# EAGLE design GPS Dog Tracker receiver (EAGLE 7.5.0)
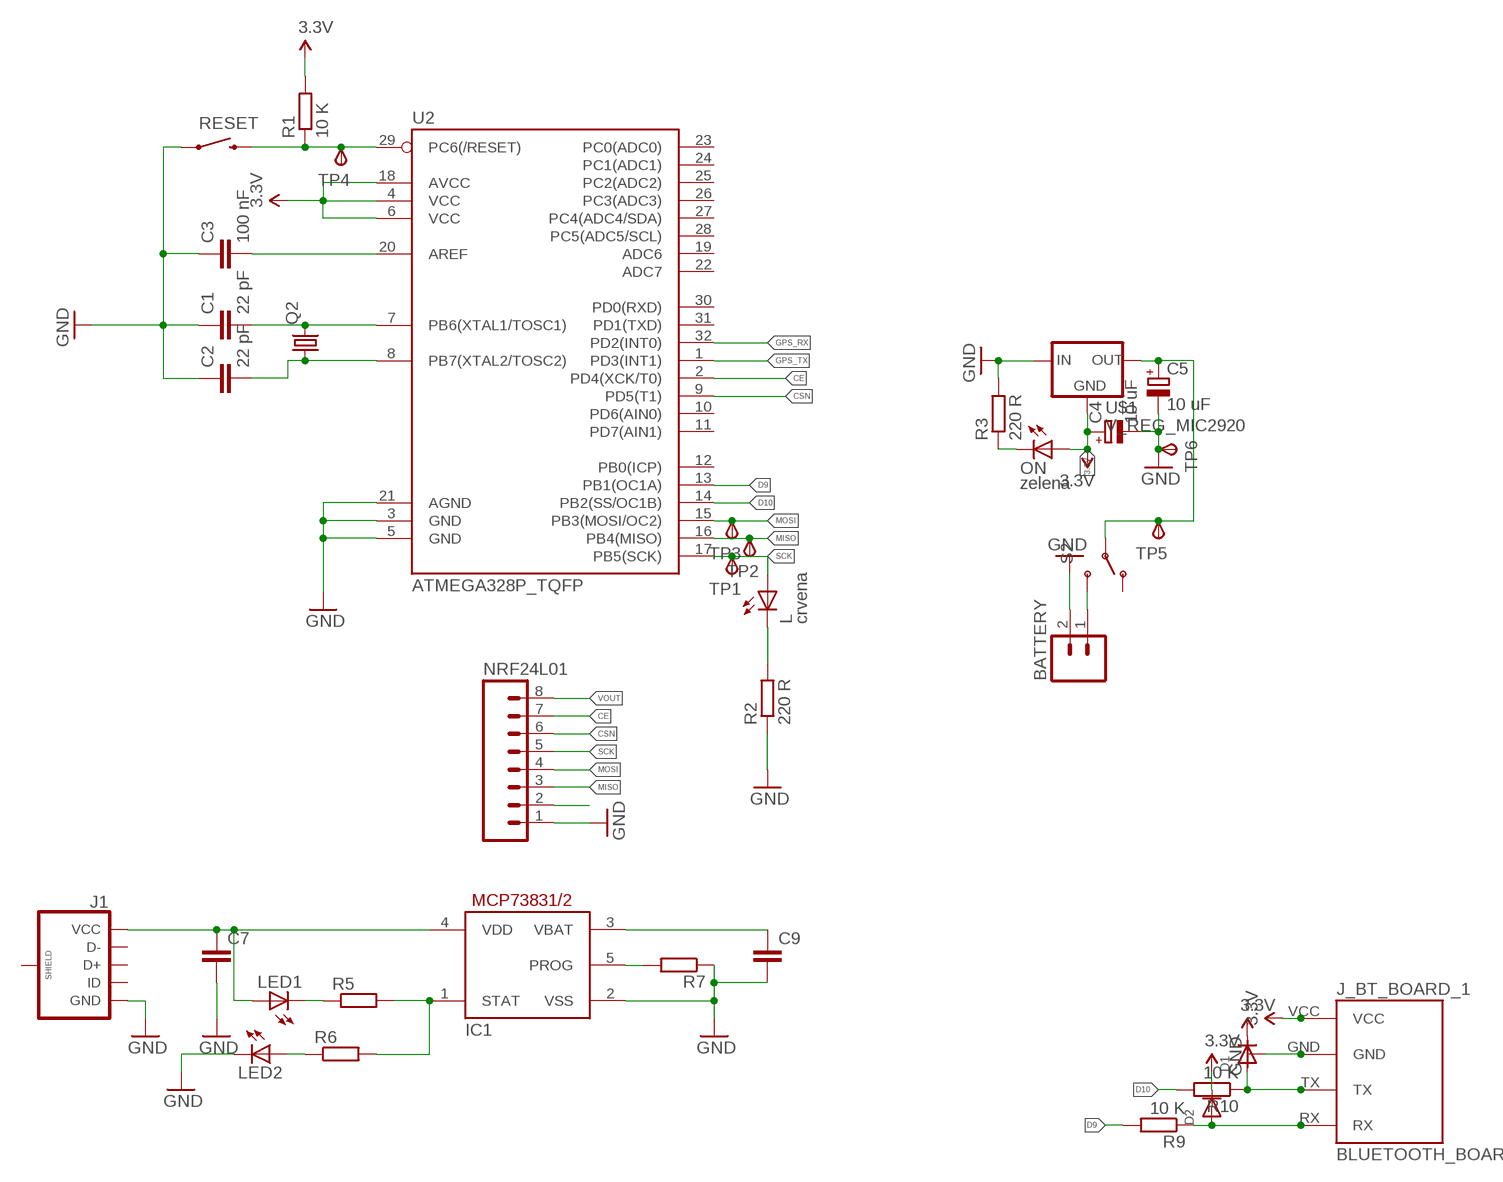
[diagram p0: schematic, sheet 1]

## Parts
BATTERY  M021X02_NO_SILK  [1X02_NO_SILK]
C1  22 pF  C-EUC0603  [C0603]
C2  22 pF  C-EUC0603  [C0603]
C3  100 nF  C-EUC0603  [C0603]
C4  10 uF  CPOL-EUSMCA  [SMC_A]
C5  10 uF  CPOL-EUSMCA  [SMC_A]
C7  C-EUC0603  [C0603]
C9  C-EUC0603  [C0603]
D1  DIODESOD-123  [SOD-123]
D2  DIODESOD-123  [SOD-123]
IC1  MCP73831/OT  [SOT23-5L]
J1  USB_MICROB_PLUGCONN-11752  [USB-B-MICRO-SMD_V03]
J_BT_BOARD_1  BLUETOOTH_BOARD  [BT_BOARD_FOOTPRINT]
L  crvena  LEDCHIP-LED0805  [CHIP-LED0805]
LED1  LEDCHIPLED_0805  [CHIPLED_0805]
LED2  LEDCHIPLED_0805  [CHIPLED_0805]
NRF24L01  M08SILK_FEMALE_PTH  [1X08]
ON  zelena  LEDCHIP-LED0805  [CHIP-LED0805]
Q2  CRYSTALHC49S  [HC49/S]
R1  10 K  R-EU_R0603  [R0603]
R2  220 R  R-EU_R0603  [R0603]
R3  220 R  R-EU_R0603  [R0603]
R5  R-EU_R0603  [R0603]
R6  R-EU_R0603  [R0603]
R7  R-EU_R0603  [R0603]
R9  10 K  R-EU_R0603  [R0603]
R10  10 K  R-EU_R0603  [R0603]
RESET  SWITCH-MOMENTARY-2SMD-1101NE  [TACTILE-SWITCH-1101NE]
S2  SWITCH-SPDT-SMD-A  [SWITCH-SPST-SMD-A]
TP1  TPSTP13R  [TP13R]
TP2  TPSTP13R  [TP13R]
TP3  TPSTP13R  [TP13R]
TP4  TPSTP13R  [TP13R]
TP5  TPSTP13R  [TP13R]
TP6  TPSTP13R  [TP13R]
U2  ATMEGA328P_TQFP  [TQFP32-08]
U$1  V_REG_MIC2920  [SOT223]

## Nets
3.3V: C4.+ D1.C D2.C J_BT_BOARD_1.VCC ON.A R1.2 U2.4(VCC) U2.6(VCC) U2.18(AVCC) U$1.2(GND)
CE: NRF24L01.7 U2.2(PD4(XCK/T0))
CSN: NRF24L01.6 U2.9(PD5(T1))
D9: R9.2 U2.13(PB1(OC1A))
D10: R10.2 U2.14(PB2(SS/OC1B))
GND: BATTERY.2 C1.1 C2.1 C3.1 C4.- C5.- C7.2 C9.2 IC1.2(VSS) J1.GND J_BT_BOARD_1.GND LED2.C NRF24L01.1 R2.1 R3.2 R7.1 RESET.1 TP6.TP(PP) U2.3(GND) U2.5(GND) U2.21(AGND) U$1.1(IN)
GPS_RX: U2.32(PD2(INT0))
GPS_TX: U2.1(PD3(INT1))
MISO: NRF24L01.3 TP2.TP(PP) U2.16(PB4(MISO))
MOSI: NRF24L01.4 TP3.TP(PP) U2.15(PB3(MOSI/OC2))
N$1: C1.2 Q2.2 U2.7(PB6(XTAL1/TOSC1))
N$2: C2.2 Q2.1 U2.8(PB7(XTAL2/TOSC2))
N$3: C3.2 U2.20(AREF)
N$4: ON.C R3.1
N$7: NRF24L01.2
N$8: L.C R2.2
N$9: IC1.1(STAT) R5.2 R6.2
N$10: LED1.C R5.1
N$11: LED2.A R6.1
N$13: IC1.5(PROG) R7.2
N$14: D2.A J_BT_BOARD_1.RX R9.1
N$15: D1.A J_BT_BOARD_1.TX R10.1
RESET: R1.1 RESET.2 TP4.TP(PP) U2.29(PC6(/RESET))
SCK: L.A NRF24L01.5 TP1.TP(PP) U2.17(PB5(SCK))
VIN: BATTERY.1 C9.1 IC1.3(VBAT) S2.3(S)
VIN1: C5.+ C7.1 IC1.4(VDD) J1.VBUS(VCC) LED1.A S2.2(P) TP5.TP(PP) U$1.3(OUT)
VOUT: NRF24L01.8
Unconnected: J1.D+ J1.D- J1.ID J1.SHIELD1(SHIELD) J1.SHIELD2(SHIELD) J1.SHIELD3(SHIELD) S2.1(O) U2.10(PD6(AIN0)) U2.11(PD7(AIN1)) U2.12(PB0(ICP)) U2.19(ADC6) U2.22(ADC7) U2.23(PC0(ADC0)) U2.24(PC1(ADC1)) U2.25(PC2(ADC2)) U2.26(PC3(ADC3)) U2.27(PC4(ADC4/SDA)) U2.28(PC5(ADC5/SCL)) U2.30(PD0(RXD)) U2.31(PD1(TXD))

## Library data of the parts
BATTERY = SparkFun-Connectors:M02: Standard 2-pin 0.1" header. Use with - straight break away headers ( PRT-00116) - right angle break away headers (PRT-00553) - swiss pins (PRT-00743) - machine pins (PRT-00117) - female headers (PRT-00115) Molex polarized connector foot print use with: PRT-08233 with associated crimp pins and housings. 2.54_SCREWTERM for use with PRT-10571. 3.5mm Screw Terminal footprints for PRT-08084 5mm Screw Terminal footprints for use with PRT-08432
C1-C3 = rcl:C-EU: CAPACITOR, European symbol
C4 C5 = resistor:CPOL-EU: POLARIZED CAPACITOR, European symbol
C7 C9 = resistor:C-EU: CAPACITOR, European symbol
D1 D2 = adafruit:DIODE: Diode SMADIODE - SMA Surface Mount Package 20V 1A Schottky Diode Digikey: 641-1014-6-ND DO-1N4148 - Through Hole Small Current Diode SOD-123 20V 1 A (.5mV Vf) Schottky Diode - Digikey: MBRX120TPMSCT-ND SOD-323 10V 570mA (.38mV Vf, 3ns) Schottky Diode - Digikey: ZLLS410CT-ND SOD-523 30V 30mA Schottky Diode (RB751S-40TE61) - Digikey: RB751S-40TE61CT-ND SOT23-R/W - SOT23 Package (R = Solder Paste/Reflow Ovens, W = Hand-Soldering) BAT54Film 40V 300mA - Digikey: 497-7162-1-ND
IC1 = adafruit:MCP73831: MCP73831/2 Miniature Single-Cell, Fully Integrated Li-Ion, Li-Polymer Charge Management Controllers. Nice and small simple lipoly charge controller, with adjustable current and status output (LED) http://www.ladyada.net/library/pcb/eaglelibrary.html
J1 = SparkFun-Connectors:USB_MICROB_PLUG: USB Micro-B connectors Some male, some female. Watch your step!; PROD_ID: CONN-11752
J_BT_BOARD_1 = Bluetooth HC-05:BLUETOOTH_BOARD: Bluetooth Board V1.05
L LED1 LED2 ON = adafruit:LED: LED OSRAM: - CHIPLED LG R971, LG N971, LY N971, LG Q971, LY Q971, LO R971, LY R971 LH N974, LH R974 LS Q976, LO Q976, LY Q976 LO Q996 - Hyper CHIPLED LW Q18S LB Q993, LB Q99A, LB R99A - SideLED LS A670, LO A670, LY A670, LG A670, LP A670 LB A673, LV A673, LT A673, LW A673 LH A674 LY A675 LS A676, LA A676, LO A676, LY A676, LW A676 LS A679, LY A679, LG A679 - Hyper Micro SIDELED® LS Y876, LA Y876, LO Y876, LY Y876 LT Y87S - SmartLED LW L88C, LW L88S LB L89C, LB L89S, LG L890 LS L89K, LO L89K, LY L89K LS L896, LA L896, LO L896, LY L896 - TOPLED LS T670, LO T670, LY T670, LG T670, LP T670 LSG T670, LSP T670, LSY T670, LOP T670, LYG T670 LG T671, LOG T671, LSG T671 LB T673, LV T673, LT T673, LW T673 LH T674 LS T676, LA T676, LO T676, LY T676, LB T676, LH T676, LSB T676, LW T676 LB T67C, LV T67C, LT T67C, LS T67K, LO T67K, LY T67K, LW E67C LS E67B, LA E67B, LO E67B, LY E67B, LB E67C, LV E67C, LT E67C LW T67C LS T679, LY T679, LG T679 LS T770, LO T770, LY T770, LG T770, LP T770 LB T773, LV T773, LT T773, LW T773 LH T774 LS E675, LA E675, LY E675, LS T675 LS T776, LA T776, LO T776, LY T776, LB T776 LHGB T686 LT T68C, LB T68C - Hyper Mini TOPLED® LB M676 - Mini TOPLED Santana® LG M470 LS M47K, LO M47K, LY M47K Source: http://www.osram.convergy.de/
NRF24L01 = SparkFun-Connectors:M08: Header 8 Standard 8-pin 0.1" header. Use with straight break away headers (SKU : PRT-00116), right angle break away headers (PRT-00553), swiss pins (PRT-00743), machine pins (PRT-00117), and female headers (PRT-00115).; PROD_ID: CONN-08438
Q2 = adafruit:CRYSTAL: CRYSTAL; OC_FARNELL: 1667008; OC_NEWARK: unknown
R1-R3 R5-R7 R9 R10 = rcl:R-EU_: RESISTOR, European symbol
RESET = SparkFun-Electromechanical:SWITCH-MOMENTARY-2: Various NO switches- pushbuttons, reed, etc; PROD_ID: SWCH-00815
S2 = SparkFun-Electromechanical:SWITCH-SPDT: SPDT Switch Simple slide switch, Spark Fun Electronics SKU : COM-00102 DPDT SMT slide switch, AYZ0202, SWCH-08179; PROD_ID: SWCH-10651
TP1-TP6 = testpad:TPS: TEST PIN
U2 = SparkFun-DigitalIC:ATMEGA328P_TQFP; PROD_ID: IC-09069
U$1 = SparkFun-PowerIC:V_REG_MIC2920: MIC2920A (http://www.micrel.com/_PDF/mic2920.pdf) - 400mA output LDO Regulator

## Board
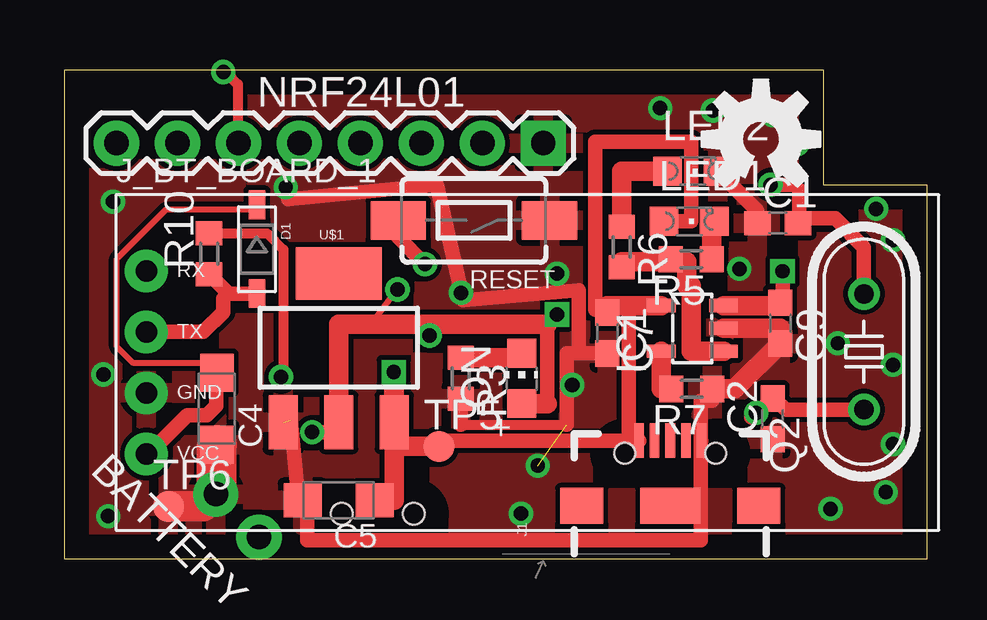
[diagram p1: board, top side]
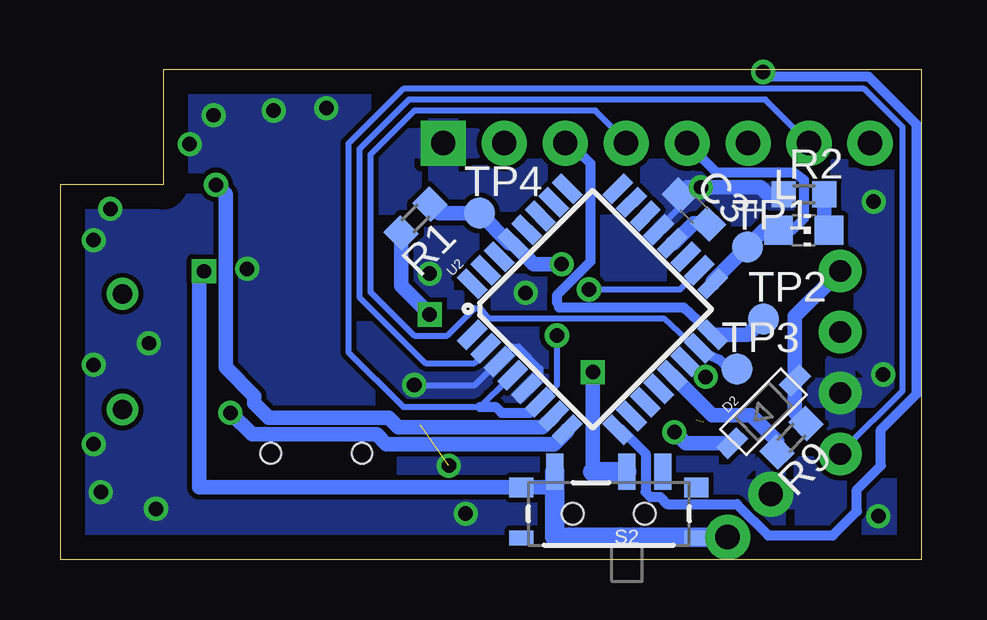
[diagram p2: board, bottom side, seen from below]

Size 35.9 x 20.4 mm. Coordinates in mm from the lower left corner, seen from the top.
Outline: 0,20.4 31.6,20.4 31.6,15.6 35.9,15.6 35.9,0 0,0 0,20.4
Copper layers (1*16): Top 0.035mm / dielectric 1.5mm / Bottom 0.035mm
Design rules "default": minimum track width 10mil, minimum drill 24mil, track to track 8mil, track to pad 8mil, pad to pad 8mil, via to via 8mil, smd to smd 8mil, copper to edge 40mil, drill to drill 8mil, minimum pad ring 10mil, minimum via ring 8mil, stop-mask expansion 4mil, vias tented up to drill 0mil, thermal gap 10mil

### Footprints (pad centres in the part's own frame; a part is rotated, then mirrored left to right if it is on the bottom)
1X02_NO_SILK = drill 1.016 pad 1.88: 1 0,0; 2 2.54,0
C0603 = smd 1.1 x 1: 1 -0.85,0; 2 0.85,0
SMC_A = smd 1.6 x 1.4: + -1.5,0; - 1.5,0
SOD-123 = smd 1.2 x 0.7: A 1.85,0; C -1.85,0
SOT23-5L = smd 0.55 x 1.2: 1 -0.95,-1.3; 2 0,-1.3; 3 0.95,-1.3; 4 0.95,1.3; 5 -0.95,1.3
USB-B-MICRO-SMD_V03 = smd 1.45 x 0.4: D+ 2.725,0; D- 2.725,0.65; GND 2.725,-1.3; ID 2.725,-0.65; VBUS 2.725,1.3 | smd 1.5 x 1.8: SHIELD1 0,3.685; SHIELD2 0,-3.685 | smd 1.5 x 2.5: SHIELD3 0,0 | hole 0.85: 2.2,1.9; 2.2,-1.9
BT_BOARD_FOOTPRINT = drill 0.9 pad 1.778: GND -16.51,-1.27; RX -16.51,3.81; TX -16.51,1.27; VCC -16.51,-3.81
CHIP-LED0805 = smd 1.2 x 1.2: A 0,-1.05; C 0,1.05
CHIPLED_0805 = smd 1.2 x 1.2: A 0,-1.05; C 0,1.05
1X08 = drill 1.016 pad 1.88 square: 1 0,0 | drill 1.016 pad 1.88: 2 2.54,0; 3 5.08,0; 4 7.62,0; 5 10.16,0; 6 12.7,0; 7 15.24,0; 8 17.78,0
HC49/S = drill 0.813: 1 -2.413,0; 2 2.413,0
R0603 = smd 1 x 1.1: 1 -0.85,0; 2 0.85,0
TACTILE-SWITCH-1101NE = smd 2.3 x 1.6: 1 -3.15,0; 2 3.15,0
SWITCH-SPST-SMD-A = smd 0.7 x 1.5: 1 -2.25,-1.75; 2 -0.75,-1.75; 3 2.25,-1.75 | smd 1 x 0.6: GND1 -3.65,1; GND3 3.65,1 | smd 1 x 0.8: GND2 -3.65,-1.1; GND4 3.65,-1.1 | hole 0.9: -1.5,0; 1.5,0
TP13R = smd 1.3 x 1.3: TP 0,0
TQFP32-08 = smd 1.27 x 0.559: 1 -4.293,2.8; 2 -4.293,2; 3 -4.293,1.2; 4 -4.293,0.4; 5 -4.293,-0.4; 6 -4.293,-1.2; 7 -4.293,-2; 8 -4.293,-2.8; 17 4.293,-2.8; 18 4.293,-2; 19 4.293,-1.2; 20 4.293,-0.4; 21 4.293,0.4; 22 4.293,1.2; 23 4.293,2; 24 4.293,2.8 | smd 0.559 x 1.27: 9 -2.8,-4.293; 10 -2,-4.293; 11 -1.2,-4.293; 12 -0.4,-4.293; 13 0.4,-4.293; 14 1.2,-4.293; 15 2,-4.293; 16 2.8,-4.293; 25 2.8,4.293; 26 2,4.293; 27 1.2,4.293; 28 0.4,4.293; 29 -0.4,4.293; 30 -1.2,4.293; 31 -2,4.293; 32 -2.8,4.293
SOT223 = smd 1.219 x 2.235: 1 -2.311,-3.099; 2 0,-3.099; 3 2.311,-3.099 | smd 3.6 x 2.2: 4 0,3.099

### Placement (x,y rotation side)
BATTERY  8.08,0.92 135 top
C1  29.7,14.01 0 top
C2  29.49,5.85 90 top
C3  9.49,14.58 315 bottom
C4  6.33,6.27 270 top
C5  11.41,2.46 180 top
C7  22.6,9.43 270 top
C9  29.8,9.84 270 top
D1  8,12.92 270 top
D2  6.59,6.15 45 bottom
IC1  26.14,9.62 90 top
J1  25.22,2.22 90 top
J_BT_BOARD_1  19.9,8.2 0 top
L  4.91,13.71 270 bottom
LED1  26.01,14.08 270 top
LED2  26.16,16.17 270 top
NRF24L01  19.93,17.34 180 top
ON  19.03,7.54 0 top
Q2  33.29,8.65 90 top
R1  21.09,14.2 225 bottom
R2  4.9,15.21 0 bottom
R3  16.49,7.54 270 top
R5  26.1,12.5 180 top
R6  23.2,13.01 270 top
R7  26.12,7.1 180 top
R9  5.42,5.06 225 bottom
R10  6.01,12.73 90 top
RESET  17.04,14.12 180 top
S2  13.03,1.89 180 bottom
TP1  7.26,13.02 0 bottom
TP2  6.58,10.02 0 bottom
TP3  7.7,7.92 0 bottom
TP4  18.42,14.42 0 bottom
TP5  15.59,4.7 0 top
TP6  4.31,2.2 0 top
U2  13.71,10.42 45 bottom
U$1  11.41,8.81 0 top
U$2  [OSHW-LOGO-M]  29,17.5 0 top

### Tracks (layer width: path | path; a pad name or v marks a point on that pad's centre or on a via)
3.3V  (via drill 0.6, 0.61)
  Top 0.254: D1.C 7.88,14.58 4.22,14.58 2.16,12.52 2.16,8.86 2.85,8.18 6.28,8.18 C4.+ | v15.2,9.32 15.2,9.8 | v13.85,11.25 12.91,10 12.91,9.8
  Top 0.61: 20.1,6.49 20.1,9.8 v20.5,10.2 | J_BT_BOARD_1.VCC 3.49,4.39 5.1,6 5.9,6 6.3,6.4 6.3,7.74 C4.+ | v10.3,5.3 11,5.3 U$1.2
  Top 0.813: U$1.2 11.41,9.8 12.91,9.8 15.2,9.8 20.1,9.8 | ON.A 20.1,6.49
  Bottom 0.254: v15.2,9.32 15.2,7.26 15.88,6.58 U2.6 | v13.85,11.25 10.07,11.25 9.48,11.83 U2.18 | U2.4 17.25,7.49 18.4,6.35 21.6,6.35 23.88,8.63 23.88,17.32 21.6,19.61 2.39,19.61 0.79,18.01 0.79,7.03 3.31,4.52 J_BT_BOARD_1.VCC
  Bottom 0.406: 18.4,6.35 17.75,6.35 17.5,6.1 16.33,6.1 U2.6
  Bottom 0.61: R1.2 21.69,11.39 v20.5,10.2 | D2.C 9.84,4.84 v10.3,5.3
CE
  Bottom 0.254: U2.2 18.17,8.63 18.62,8.18 20.68,8.18 23.42,10.92 23.42,17.09 21.37,19.15 6.51,19.15 4.91,17.55 NRF24L01.7
CSN  (via drill 0.6)
  Top 0.406: v6.6,20.3 6.8,20.2 7.2,19.8 7.2,17.37 NRF24L01.6
  Bottom 0.406: U2.9 12.5,5.4 11.5,4.4 11.5,2.8 11.3,2.6 10.9,2.6 10.6,2.3 7.7,2.3 6.4,1 3.7,1 2.7,2 2.7,2.9 1.7,3.9 1.7,5.4 0.2,6.9 0.2,18.1 2.2,20.1 6.5,20.1 v6.6,20.3
D9
  Bottom 0.61: R9.2 6.02,4.92 7.1,6 8.72,6 U2.13
D10  (via drill 0.6)
  Top 0.406: R10.2 8.42,13.58 9.1,12.9 9.1,7.7 v9,7.6
  Bottom 0.406: v9,7.6 9.19,7.6 U2.14
GND  (via drill 0.6, 0.61)  (2 unrouted)
  Top 0.254: v21.14,7.26 20.9,7.26
  Top 0.406: 16.49,5.6 20.9,5.6
  Top 0.61: J1.GND 26.5,4.95 | 26.5,4.95 26.5,6.6 26.97,6.6 R7.1 | 26.5,4.95 26.5,0.8 10.1,0.8 10.1,2.8 9.7,2.8 9.4,5.8 | 21.4,8.58 21.4,11.2 16.6,10.8 15.5,15.6 9.3,15 9.3,15.4 v9.2,15.5 | 21.4,8.58 C7.2 | R3.2 16.49,5.6 | 20.9,5.6 20.9,7.26 20.9,8.58 21.4,8.58 | C1.1 28.85,14.53 LED2.C
  Top 0.813: IC1.2 29.8,9.62 C9.2 27.91,7.1 R7.1
  Top 1.27: TP6.TP 5.77,2.2 BATTERY.2
  Top 1.676: BATTERY.2 6.33,2.72 C4.-
  Bottom 0.254: U2.5 16.34,7.26 15.88,7.72 15.88,7.95 16.79,8.86 17.02,8.86 17.48,8.4 U2.3 17.71,8.18 18.62,7.26 v21.14,7.26 | U2.21 10.85,13.89 10.16,14.58 10.16,15.03 C3.1
  Bottom 0.61: R2.1 6.41,15.21 6.7,15.5 v9.2,15.5 9.77,15.5 C3.1
  other vias: 19.7,3.9 19,1.9 31.9,2.1 34.2,2.8 34.5,4.8 34.5,8.1 32.2,9 34.5,13.3 33.8,14.6 30.5,17.3 29.5,18.5 27,18.7 24.8,18.8 16.5,11.1 20.5,11.9 2,14.9 1.6,7.7 1.8,1.8 28.1,12.1
  pour Bottom: -56.1,59.6 44.3,59.6 44.3,-21 -56.1,-21
  pour Top: -56.1,59.4 44.1,59.4 44.1,-20.6 -56.1,-20.6
  pour Bottom: -0.4,21 38,21 38,-2.8 -0.4,-2.8
MISO
  Bottom 0.406: NRF24L01.3 14.64,17.34 13.8,16.5 13.8,12.4 15.2,11 15.2,10.7 15.1,10.5 9.93,10.5 U2.16
  Bottom 0.61: U2.16 7.24,9.36 TP2.TP
MOSI
  Bottom 0.254: U2.15 9.48,8.86 10.75,10.03 18.07,10.03 18.4,10.46 18.62,10.46 19.77,9.32 21.14,9.32 22.97,11.15 22.97,16.86 21.14,18.69 13.59,18.69 12.45,17.55 NRF24L01.4
  Bottom 0.406: TP3.TP 8.02,7.92 8.4,8.3 8.86,8.5 U2.15
N$1  (via drill 0.6)
  Top 0.61: Q2.2 33.29,13.01 32.1,14.2 30.74,14.2 C1.2 30.6,14.06 30.6,15.4 30.4,15.6 v29.4,15.6
  Bottom 0.61: U2.7 | U2.7 15.8,5.5 21.8,5.5 22.2,5.9 27.2,5.9 27.8,6.5 27.8,6.8 29,8 29,15.2 v29.4,15.6
N$2  (via drill 0.6)
  Top 0.61: Q2.1 30.05,6.24 C2.2 28.6,5.91 v28.8,6.1
  Bottom 0.61: U2.8 14.77,5.34 15.3,4.8 22.3,4.8 22.7,5.2 27.9,5.2 v28.8,6.1
N$3
  Bottom 0.61: U2.20 10.33,13.17 9.5,14 8.92,14 C3.2
N$4
  Top 0.813: R3.1 19.03,8.39 ON.C
N$8
  Bottom 0.61: R2.2 4.05,13.9 L.C
N$9
  Top 0.813: IC1.1 26.1,8.67 26.1,11.4 25.9,11.4 25.9,12.4 25.25,12.4 | 25.25,12.4 R5.2 | 25.25,12.4 23.2,12.4 R6.2
N$10
  Top 0.813: LED1.C 26.95,14.08 R5.1
N$11
  Top 0.813: LED2.A 23.2,16.17 R6.1
N$13
  Top 0.813: IC1.5 24.84,7.1 R7.2
N$14
  Bottom 0.61: R9.1 5.28,6.12 D2.A 5.28,10.12 J_BT_BOARD_1.RX
N$15
  Top 0.61: D1.A 6.82,11.07 | 6.82,11.07 R10.1 | J_BT_BOARD_1.TX 5.77,9.47 6.6,10.3 6.6,10.85 6.82,11.07
RESET  (via drill 0.6)
  Top 0.61: RESET.2 13.89,13.41 v15,12.3
  Bottom 0.61: R1.1 20.11,14.42 TP4.TP 17.17,13.17 U2.29 16.16,12.3 v15,12.3
SCK
  Bottom 0.406: 6.57,13.71 5.39,13.71 4.9,14.2 4.9,15.8 5.3,16.1 8.53,16.1 NRF24L01.5
  Bottom 0.61: U2.17 8.69,11.59 TP1.TP 6.57,13.71 L.A
VIN  (via drill 0.6)
  Top 0.61: v29.9,12 29.9,10.69 C9.1
  Top 0.813: C9.1 29.8,10.57 IC1.3
  Bottom 0.61: S2.3 15.28,3 30.1,3 30.1,12 v29.9,12
  Bottom 0.813: BATTERY.1 15.28,0.92 S2.3
VIN1  (via drill 0.6)
  Top 0.61: LED1.A 26.1,14.08 26.1,17.4 22.1,17.4 22.1,10.4 22.6,10.4 C7.1 | 23.5,10.57 23.5,4.95 J1.VBUS 15.59,4.95 TP5.TP
  Top 0.813: C5.+ 13.72,2.46 U$1.3 13.72,7.8 v13.7,7.8 13.7,4.7 TP5.TP | C7.1 22.6,10.57 23.5,10.57 IC1.4
  Bottom 0.61: 13.7,3.64 v13.7,7.8
  Bottom 0.813: S2.2 13.7,3.64